# Altium schematic sheet Power.SchDoc
size A4; SheetNumber: 1; SheetTotal: 5
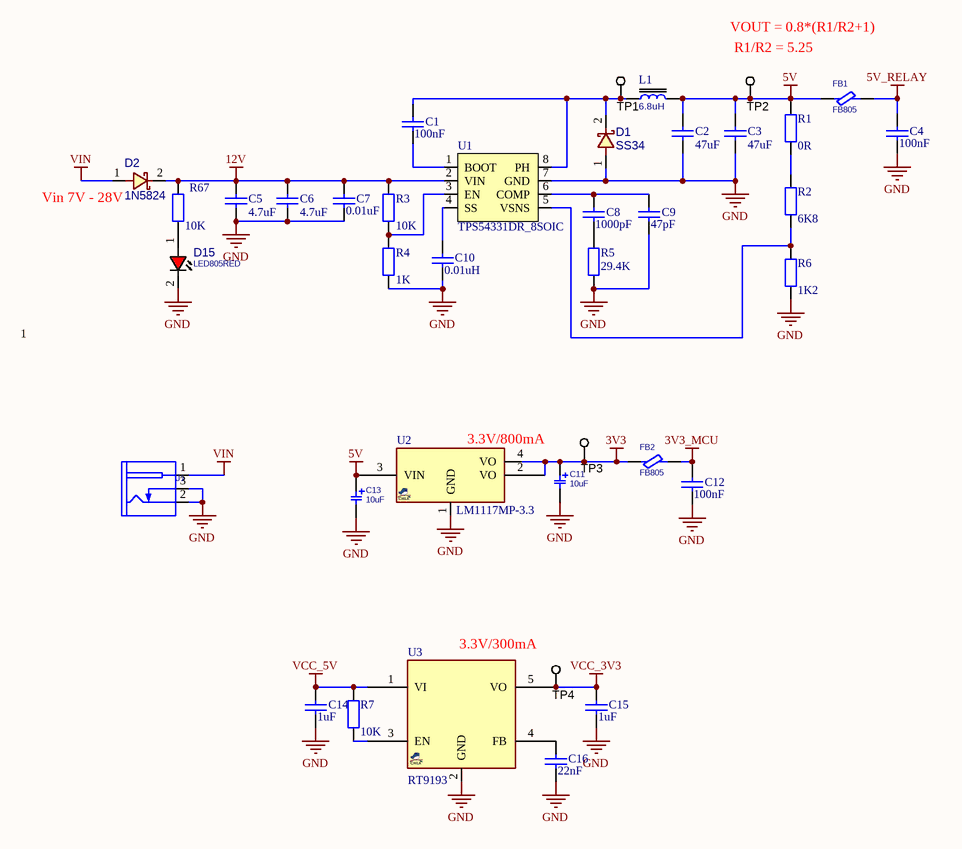
[diagram p0: Power.SchDoc]

## Parts
C1  Ma_Hang: 100nF  [tu 0603]  (hidden comment: 100nF_0603_1%)
C2  Ma_Hang: 47uF  [tu 1206]  (hidden comment: 47uF_1206_1%)
C3  Ma_Hang: 47uF  [tu 1206]  (hidden comment: 47uF_1206_1%)
C4  Ma_Hang: 100nF  [tu 0603]  (hidden comment: 100nF_0603_1%)
C5  Ma_Hang: 4.7uF  [tu 1206]  (hidden comment: 4.7uF_1206_1%)
C6  Ma_Hang: 4.7uF  [tu 1206]  (hidden comment: 4.7uF_1206_1%)
C7  Ma_Hang: 0.01uF  [tu 0603]  (hidden comment: 0.01uF_0603_1%)
C8  Ma_Hang: 1000pF  [tu 0603]  (hidden comment: 1000pF_0603_1%)
C9  Ma_Hang: 47pF  [tu 0603]  (hidden comment: 47pF_0603_1%)
C10  Ma_Hang: 0.01uH  [tu 0603]  (hidden comment: 0.01uF_0603_1%)
C11  value 10uF  [C_TN_3216]  (hidden comment: 10uF/6.3V)
C12  Ma_Hang: 100nF  [tu 0603]  (hidden comment: 100nF_0603_1%)
C13  value 10uF  [C_TN_3216]  (hidden comment: 10uF/10V)
C14  Ma_Hang: 1uF  [tu 0603]  (hidden comment: 1uF_0603_1%)
C15  Ma_Hang: 1uF  [tu 0603]  (hidden comment: 1uF_0603_1%)
C16  Ma_Hang: 22nF  [tu 0603]  (hidden comment: 22nF_0603_1%)
D1  value SS34  [D_SMB]  (hidden comment: SS34_SMA)
D2  value 1N5824  [D_SMA]  (hidden comment: SS54_SMA)
D15  LED805RED  [LED0805RED]
FB1  FB805  [L0805]
FB2  FB805  [L0805]
J1  DC_POWER_JACK  [JAC_PWR2]  (value not drawn)
L1  value 6.8uH  [L_10]  (hidden comment: 6.8uH_CD104)
R1  Ma_Hang: 0R  [tro smd 0603]  (hidden comment: 0R_0603_1%)
R2  Ma_Hang: 6K8  [tro smd 0603]  (hidden comment: 6K8_0603_1%)
R3  Ma_Hang: 10K  [tro smd 0603]  (hidden comment: 10K_0603_1%)
R4  Ma_Hang: 1K  [tro smd 0603]  (hidden comment: 1K_0603_1%)
R5  Ma_Hang: 29.4K  [tro smd 0805]  (hidden comment: 29.4K_0805_1%)
R6  Ma_Hang: 1K2  [tro smd 0603]  (hidden comment: 1K2_0603_1%)
R7  Ma_Hang: 10K  [tro smd 0603]  (hidden comment: 10K_0603_1%)
R67  Ma_Hang: 10K  [tro smd 0603]  (hidden comment: 10K_0603_1%)
TP1  TESTPOINT_PROBE  [TEST_POINT_1.0X1.0MM]  (value not drawn)  (no BOM)
TP2  TESTPOINT_PROBE  [TEST_POINT_1.0X1.0MM]  (value not drawn)  (no BOM)
TP3  TESTPOINT_PROBE  [TEST_POINT_1.0X1.0MM]  (value not drawn)  (no BOM)
TP4  TESTPOINT_PROBE  [TEST_POINT_1.0X1.0MM]  (value not drawn)  (no BOM)
U1  TPS54331DR_8SOIC  [SOIC-8N]
U2  value LM1117MP-3.3  [SOT223_4]  (hidden comment: LM1117IMP-3.3/NOPB)
U3  RT9193  [SOT23_5]

## Nets
3V3: C11.1 FB2.1 TP3.1 U2.2(VO) U2.4(VO)
3V3_MCU: C12.1 FB2.2
5V: C2.1 C3.1 C13.1 FB1.1 L1.2 R1.2 TP2.1 U2.3(VIN)
5V_RELAY: C4.1 FB1.2
12V: C5.1 C6.1 C7.1 D2.2 R3.2 R67.2 U1.2(VIN)
GND: C2.2 C3.2 C4.2 C5.2 C6.2 C7.2 C9.2 C10.2 C11.2 C12.2 C13.2 C14.2 C15.2 C16.2 D1.1 D15.2(CATHODE) J1.2(SLEEVE) J1.3(INSERTION_DET) R4.1 R5.1 R6.1 U1.7(GND) U2.1(GND) U3.2(GND)
VCC_3V3: C15.1 TP4.1 U3.5(VO)
VCC_5V: C14.1 R7.2 U3.1(VI)
VIN: D2.1 J1.1(TIP)
NetC1_1: C1.1 D1.2 L1.1 TP1.1 U1.8(PH)
NetC1_2: C1.2 U1.1(BOOT)
NetC8_1: C8.1 C9.1 U1.6(COMP)
NetC8_2: C8.2 R5.2
NetC10_1: C10.1 U1.4(SS)
NetC16_1: C16.1 U3.4(FB)
NetD15_1: D15.1(ANODE) R67.1
NetR1_1: R1.1 R2.2
NetR2_1: R2.1 R6.2 U1.5(VSNS)
NetR3_1: R3.1 R4.2 U1.3(EN)
NetR7_1: R7.1 U3.3(EN)

## Notes on the sheet
- VOUT = 0.8*(R1/R2+1)
- R1/R2 = 5.25
- (near D2) Vin 7V - 28V
- 1
- (near U2) 3.3V/800mA
- 3.3V/300mA

## Library data of the parts
C1 C4 C7-C9 C12 C14-C16 = Tu 0603 470pF 50V 10%: Capacitor, Ceramic, 50V; Chung_Loai: Dán; Don_Vi: Con; So_Chan: 2; Ten_Linh_Kien: Tụ 0603 470P 50V 10%; Kieu_Chan: *
C2 C3 C5 C6 = Tu 1206 103 50V 10%: Capacitor, Ceramic, 50V; Chung_Loai: Dán; Don_Vi: Con; So_Chan: 2; Ten_Linh_Kien: Tụ 1206 103-10nF 10% 50V; Kieu_Chan: *
C10 = Tu 0603 470pF 50V 10%: CAP SMD 0603; Chung_Loai: Dán; Don_Vi: Con; So_Chan: 2; Ten_Linh_Kien: Tụ 0603 470P 50V 10%; Kieu_Chan: *
C11 = CAP_SMD_TAN_10uF_6.3V: CAP, SMD, TAN; PARAM: 20%, 300mOhm, -55~105oC; MANF: VISHAY; MANF_P#: T55A106M6R3C0300; PARAM2: 6.3V; PRICE: 0.46$
C13 = CAP_SMD_TAN_10uF_10V: CAP, SMD, TAN; PARAM: 20%, 300mOhm, -55~105oC; MANF: VISHAY; MANF_P#: T55A106M010C0300; PARAM2: 10V; PRICE: 0.46$
D1 = DIODE_SMD_SCHOTTKY_SS34: DIODE, SCHOTTKY, 20V, 3A; MANF: VISHAY; DESC: DESCRIPTION; MANF_P#: SS34; ASSEMBLY: ASSEMBLY; PRICE: PRICE; PARAM2: 3A; PARAM: 20V
D2 = DIODE_SMD_SCHOTTKY_1N5822: DIODE, SCHOTTKY, 40V, 3A; MANF: DIODES; MANF_P#: 1N5822; DESC: DESCRIPTION; ASSEMBLY: ASSEMBLY; PRICE: PRICE; PARAM2: 3A; PARAM: 40V
D15 = LED_SMD_0805_RED: LED, SMD, 0805, RED; DESC: DESCRIPTION; MANF_P#: MANF_PART#; PARAM2: 2.2V; MANF: MANF; ASSEMBLY: ASSEMBLY; PRICE: 36t@Javan; VALUE: LED805RED
FB1 FB2 = FBEAD_SMD_BLM21PG221: FERRITE_Bead, 0805, 2A, 50mOhm, 220@100MHz; MANF: MURATA; MANF_P#: BLM15AG121SN1D; PARAM: 220@100MHz; PARAM2: 2A, 50mOhm; VALUE: FB805
J1 = CONN_PWR_JACKR2: CONN, PWR JACK DC, PLUG DIAM 2.0MM RA THD; MANF: CUI STACK; MANF_P#: PJ-202A, PJ-002AH, PJ-102AH, KLDX-0202; VALUE: DC_POWER_JACK
L1 = INDPWR_SMD: INDUCTOR, POWER, SMD
R1-R4 R6 R7 R67 = Tro 0603 5% 10k: RES SMD 0603; Chung_Loai: Dán; Don_Vi: Con; So_Chan: 2; Ten_Linh_Kien: Trở 0603 5% 10k; Kieu_Chan: *
R5 = Tro 0805 1% 5.1k: Dán; Don_Vi: Con; So_Chan: 2; Ten_Linh_Kien: Trở 0805 1% 5.1k; Chung_Loai: Dán; Kieu_Chan: *
TP1-TP4 = TESTPOINT_PROBE: TEST POINT; MANF: MANF; MANF_P#: MANF_P#; VALUE: VALUE
U1 = TPS54331DR: IC REG BUCK ADJ 3A 8SOIC
U2 = VREG_1117_SOT223: REG, Linear, LDO1V, 0.8A, SOT-223; MANF_P#: LD1117, LM1117, AMS1117, TLV1117, REG1117, NCP1117, LT1117, SPX1117; MANF: TI, ON, ST; PARAM2: 1.2/1.5/1.8/2.5/2.85/3.3/5V; PARAM: LDO1V, 0.8A
U3 = VREG_LDO_SOT23_5: REG, Linear, LDO, SOT-23-5; MANF_P#: AS1353, MIC5504YM5, MCP1824T-3302E/OT, ADP122AUJZ, TLV70233DBVR, LDK130M33R, NCP603SN, AP2210K, AP7331, AP2125K, RP114N; MANF: -; VALUE: RT9193